# Altium schematic sheet MCU.SchDoc: Smart MCU
size A3; Author: Rinosh Baskaran; DrawnBy: Rinosh Baskaran; SheetNumber: 1; SheetTotal: 3; SPICEModelCacheKMDLVIDU: <root> / <DocumentId>KMDLVIDU</DocumentId> / <CacheFrame Number="0"> / <Model Name="cap" Kind="MDL"> / <Text>*Default semiconductor capacitor / .MODEL CAP C()</Text> / </Model> / <Model Name="xtal" Kind="CKT"> / <Text>*Generic type:crystal pkg:HC33/51 / .SUBCKT XTAL 1 2 PARAMS: FREQ=1Meg RS=750 C=13pf Q=1000 / LX 1 3 {((Q*RS)/(6.2831852*FREQ))} IC=0.5M / CX 3 4 {(1/(Q*6.2831852*FREQ*RS))} / C0 1 2 {C} / RS 4 2 {RS} / .ENDS XTAL</Text> / </Model> / </CacheFrame> / </root>
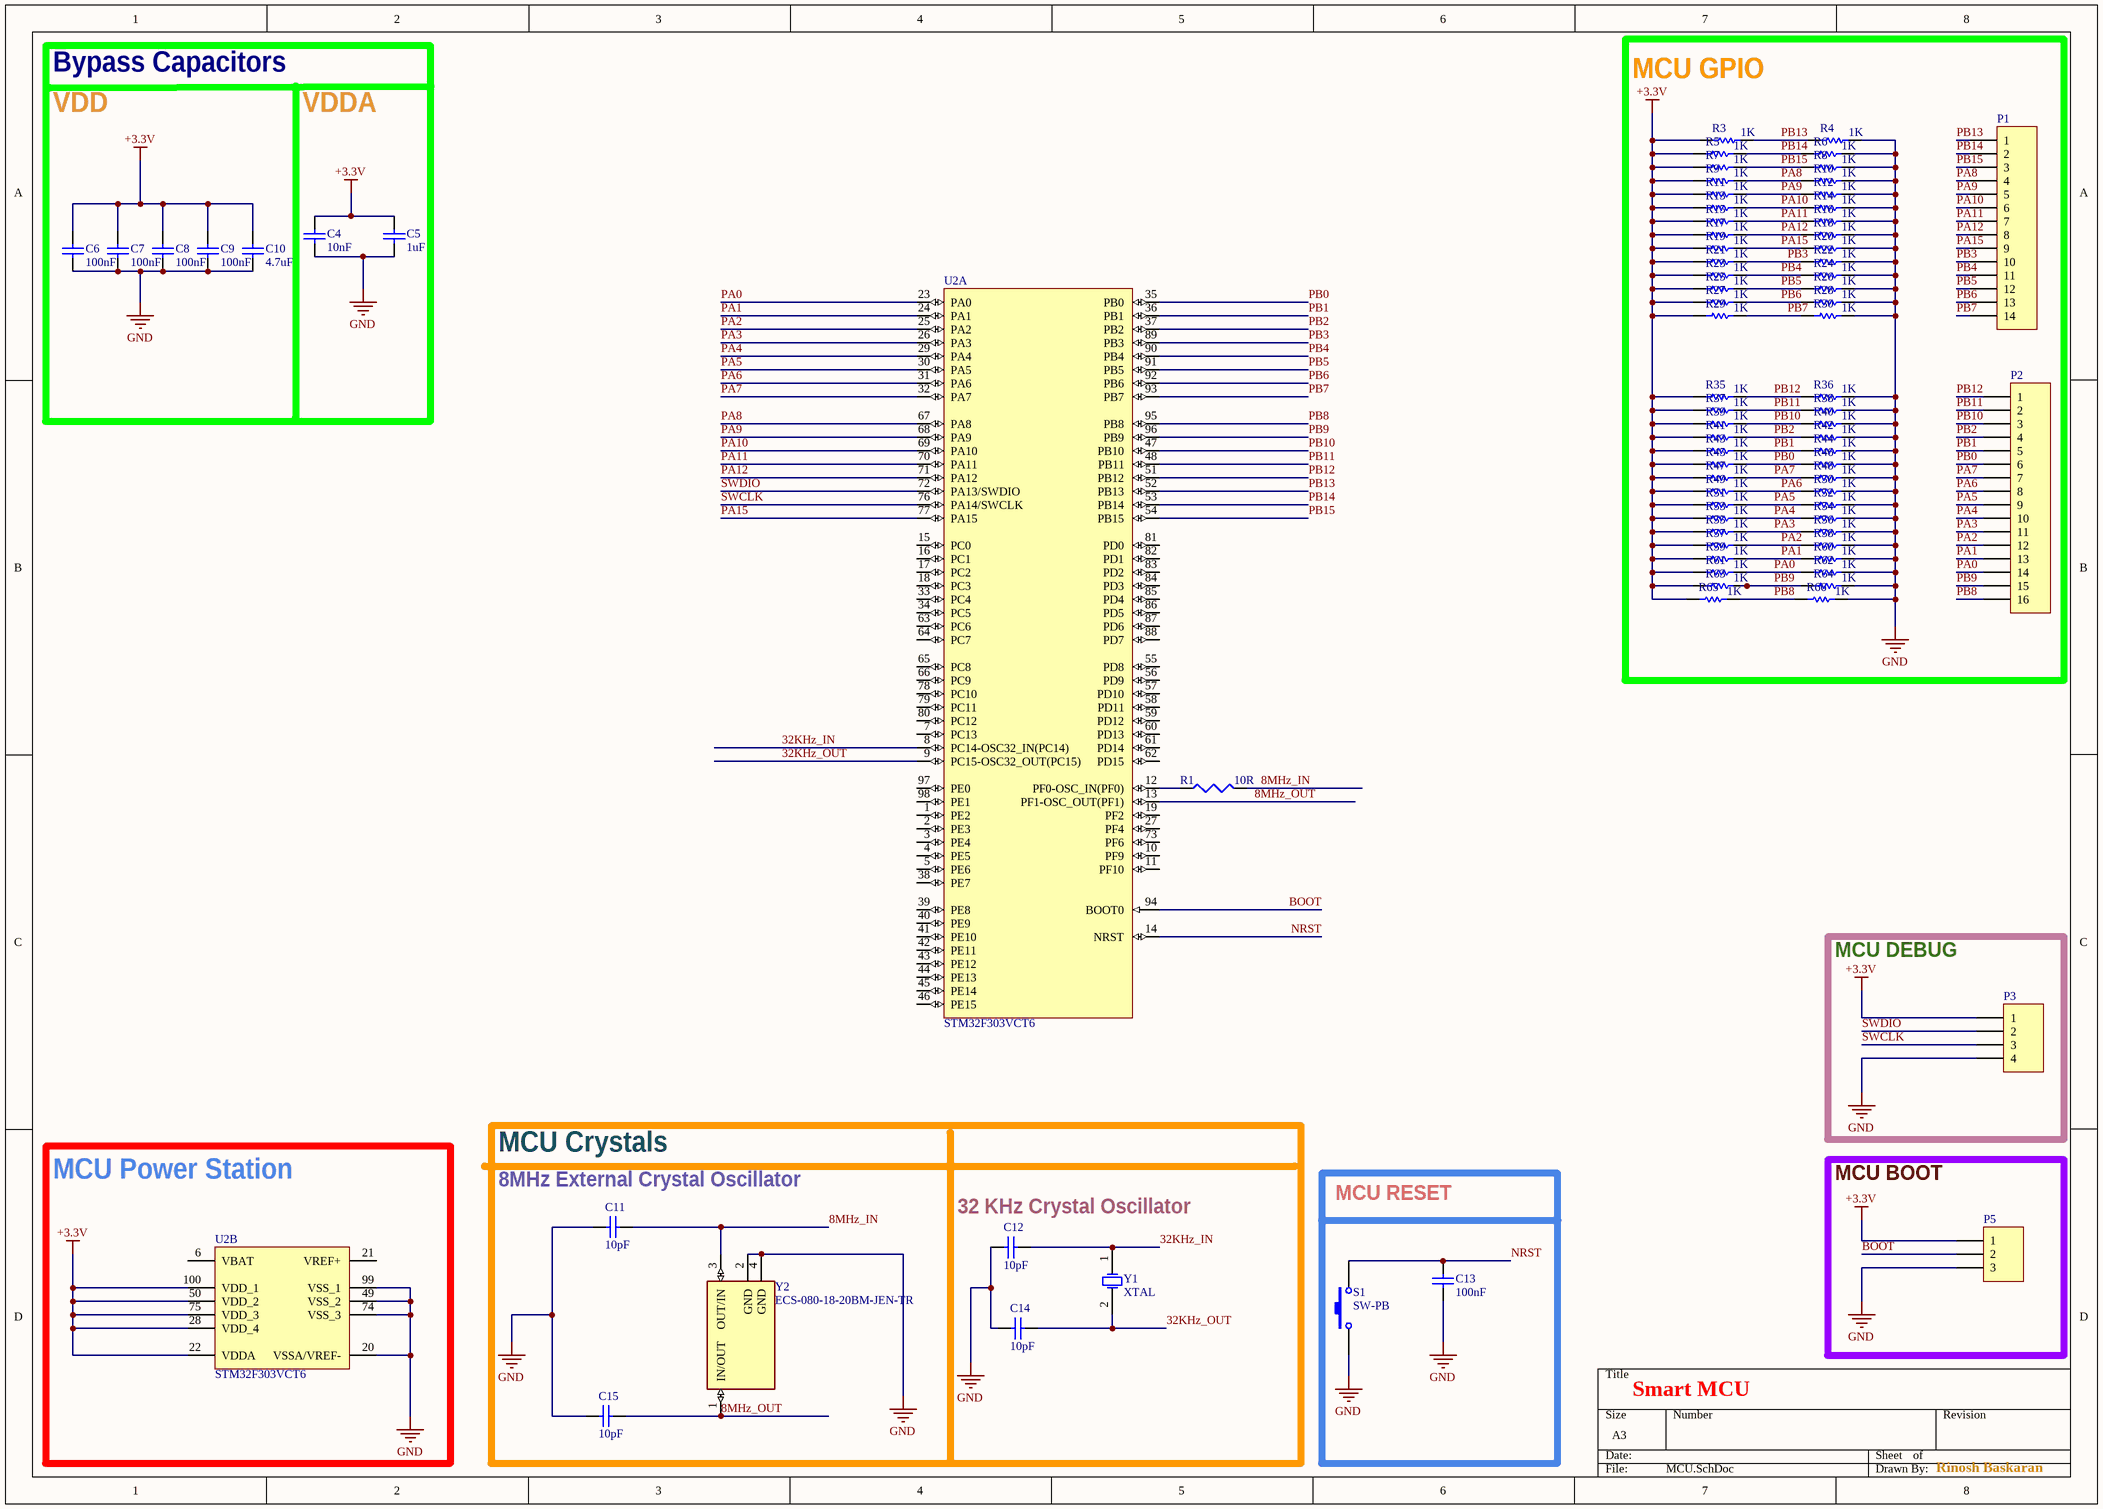
[diagram p0: MCU.SchDoc]

## Parts
C4  value 10nF  [1608[0603]]  (hidden comment: Cap Semi)
C5  value 1uF  [1608[0603]]  (hidden comment: Cap Semi)
C6  value 100nF  [1608[0603]]  (hidden comment: Cap Semi)
C7  value 100nF  [1608[0603]]  (hidden comment: Cap Semi)
C8  value 100nF  [1608[0603]]  (hidden comment: Cap Semi)
C9  value 100nF  [1608[0603]]  (hidden comment: Cap Semi)
C10  value 4.7uF  [1608[0603]]  (hidden comment: Cap Semi)
C11  value 10pF  [1608[0603]]  (hidden comment: Cap Semi)
C12  value 10pF  [1608[0603]]  (hidden comment: Cap Semi)
C13  value 100nF  [1608[0603]]  (hidden comment: Cap Semi)
C14  value 10pF  [1608[0603]]  (hidden comment: Cap Semi)
C15  value 10pF  [1608[0603]]  (hidden comment: Cap Semi)
P1  Header 14  [MY_FE14]  (value not drawn)
P2  Header 16  [MY_FE16]  (value not drawn)
P3  Header 4  [My_1X04]  (value not drawn)
P5  Header 3  [My_1X03]  (value not drawn)
R1  value 10R  [J1-0603]  (hidden comment: Res3)
R3  1K  [MY_0805]
R4  1K  [MY_0805]
R5  1K  [MY_0805]
R6  1K  [MY_0805]
R7  1K  [MY_0805]
R8  1K  [MY_0805]
R9  1K  [MY_0805]
R10  1K  [MY_0805]
R11  1K  [MY_0805]
R12  1K  [MY_0805]
R13  1K  [MY_0805]
R14  1K  [MY_0805]
R15  1K  [MY_0805]
R16  1K  [MY_0805]
R17  1K  [MY_0805]
R18  1K  [MY_0805]
R19  1K  [MY_0805]
R20  1K  [MY_0805]
R21  1K  [MY_0805]
R22  1K  [MY_0805]
R23  1K  [MY_0805]
R24  1K  [MY_0805]
R25  1K  [MY_0805]
R26  1K  [MY_0805]
R27  1K  [MY_0805]
R28  1K  [MY_0805]
R29  1K  [MY_0805]
R30  1K  [MY_0805]
R35  1K  [MY_0805]
R36  1K  [MY_0805]
R37  1K  [MY_0805]
R38  1K  [MY_0805]
R39  1K  [MY_0805]
R40  1K  [MY_0805]
R41  1K  [MY_0805]
R42  1K  [MY_0805]
R43  1K  [MY_0805]
R44  1K  [MY_0805]
R45  1K  [MY_0805]
R46  1K  [MY_0805]
R47  1K  [MY_0805]
R48  1K  [MY_0805]
R49  1K  [MY_0805]
R50  1K  [MY_0805]
R51  1K  [MY_0805]
R52  1K  [MY_0805]
R53  1K  [MY_0805]
R54  1K  [MY_0805]
R55  1K  [MY_0805]
R56  1K  [MY_0805]
R57  1K  [MY_0805]
R58  1K  [MY_0805]
R59  1K  [MY_0805]
R60  1K  [MY_0805]
R61  1K  [MY_0805]
R62  1K  [MY_0805]
R63  1K  [MY_0805]
R64  1K  [MY_0805]
R65  1K  [MY_0805]
R66  1K  [MY_0805]
S1  SW-PB  [SPST-2]
U2  STM32F303VCT6  [STM-LQFP100_N]  (parts A,B of 2)
Y1  XTAL  [R38]
Y2  ECS-080-18-20BM-JEN-TR  [ECS_ECS-060-18-20BM-JEN-TR]

## Blocks framed on the sheet
MCU GPIO: P1 P2 R3-R30 R35-R66
MCU DEBUG: P3
MCU Power Station: U2
MCU Crystals: C11 C12 C14 C15 Y1 Y2
MCU RESET: C13 S1
MCU BOOT: P5

## Nets
+3.3V: C4.2 C5.2 C6.2 C7.2 C8.2 C9.2 C10.2 P3.1 P5.1 R3.1 R5.1 R7.1 R9.1 R11.1 R13.1 R15.1 R17.1 R19.1 R21.1 R23.1 R25.1 R27.1 R29.1 R35.1 R37.1 R39.1 R41.1 R43.1 R45.1 R47.1 R49.1 R51.1 R53.1 R55.1 R57.1 R59.1 R61.1 R63.1 R65.1 U2.22(VDDA) U2.28(VDD_4) U2.50(VDD_2) U2.75(VDD_3) U2.100(VDD_1)
GND: C4.1 C5.1 C6.1 C7.1 C8.1 C9.1 C10.1 C11.2 C12.2 C13.2 C14.2 C15.2 P3.4 P5.3 R4.2 R6.2 R8.2 R10.2 R12.2 R14.2 R16.2 R18.2 R20.2 R22.2 R24.2 R26.2 R28.2 R30.2 R36.2 R38.2 R40.2 R42.2 R44.2 R46.2 R48.2 R50.2 R52.2 R54.2 R56.2 R58.2 R60.2 R62.2 R64.2 R66.2 S1.1 U2.20(VSSA/VREF-) U2.49(VSS_2) U2.74(VSS_3) U2.99(VSS_1) Y2.2(GND) Y2.4(GND)
8MHz_IN: C11.1 R1.2 Y2.3(OUT/IN)
8MHz_OUT: C15.1 U2.13(PF1-OSC_OUT(PF1)) Y2.1(IN/OUT)
32KHz_IN: C12.1 U2.8(PC14-OSC32_IN(PC14)) Y1.1(OSC1)
32KHz_OUT: C14.1 U2.9(PC15-OSC32_OUT(PC15)) Y1.2(OSC2)
BOOT: P5.2 U2.94(BOOT0)
NRST: C13.1 S1.2 U2.14(NRST)
PA0: P2.14 R61.2 R62.1 U2.23(PA0)
PA1: P2.13 R59.2 R60.1 U2.24(PA1)
PA2: P2.12 R57.2 R58.1 U2.25(PA2)
PA3: P2.11 R55.2 R56.1 U2.26(PA3)
PA4: P2.10 R53.2 R54.1 U2.29(PA4)
PA5: P2.9 R51.2 R52.1 U2.30(PA5)
PA6: P2.8 R49.2 R50.1 U2.31(PA6)
PA7: P2.7 R47.2 R48.1 U2.32(PA7)
PA8: P1.4 R9.2 R10.1 U2.67(PA8)
PA9: P1.5 R11.2 R12.1 U2.68(PA9)
PA10: P1.6 R13.2 R14.1 U2.69(PA10)
PA11: P1.7 R15.2 R16.1 U2.70(PA11)
PA12: P1.8 R17.2 R18.1 U2.71(PA12)
PA15: P1.9 R19.2 R20.1 U2.77(PA15)
PB0: P2.6 R45.2 R46.1 U2.35(PB0)
PB1: P2.5 R43.2 R44.1 U2.36(PB1)
PB2: P2.4 R41.2 R42.1 U2.37(PB2)
PB3: P1.10 R21.2 R22.1 U2.89(PB3)
PB4: P1.11 R23.2 R24.1 U2.90(PB4)
PB5: P1.12 R25.2 R26.1 U2.91(PB5)
PB6: P1.13 R27.2 R28.1 U2.92(PB6)
PB7: P1.14 R29.2 R30.1 U2.93(PB7)
PB8: P2.16 R65.2 R66.1 U2.95(PB8)
PB9: P2.15 R63.2 R64.1 U2.96(PB9)
PB10: P2.3 R39.2 R40.1 U2.47(PB10)
PB11: P2.2 R37.2 R38.1 U2.48(PB11)
PB12: P2.1 R35.2 R36.1 U2.51(PB12)
PB13: P1.1 R3.2 R4.1 U2.52(PB13)
PB14: P1.2 R5.2 R6.1 U2.53(PB14)
PB15: P1.3 R7.2 R8.1 U2.54(PB15)
SWCLK: P3.3 U2.76(PA14/SWCLK)
SWDIO: P3.2 U2.72(PA13/SWDIO)
NetR1_1: R1.1 U2.12(PF0-OSC_IN(PF0))

Not connected (* = marked no-connect by the designer): U2 1(PE2) 2(PE3) 3(PE4) 4(PE5) 5(PE6) 6(VBAT) 7(PC13) 10(PF9) 11(PF10) 15(PC0) 16(PC1) 17(PC2) 18(PC3) 19(PF2) 21(VREF+) 27(PF4) 33(PC4) 34(PC5) 38(PE7) 39(PE8) 40(PE9) 41(PE10) 42(PE11) 43(PE12) 44(PE13) 45(PE14) 46(PE15) 55(PD8) 56(PD9) 57(PD10) 58(PD11) 59(PD12) 60(PD13) 61(PD14) 62(PD15) 63(PC6) 64(PC7) 65(PC8) 66(PC9) 73(PF6) 78(PC10) 79(PC11) 80(PC12) 81(PD0) 82(PD1) 83(PD2) 84(PD3) 85(PD4) 86(PD5) 87(PD6) 88(PD7) 97(PE0) 98(PE1)

## Notes on the sheet
- Bypass Capacitors
- VDD
- VDDA
- (near C11) 8MHz External Crystal Oscillator
- (near C12) 32 KHz Crystal Oscillator

## Library data of the parts
C4-C15 = Cap Semi: Capacitor (Semiconductor SIM Model); Published: 8-Jun-2000; LatestRevisionDate: 29-May-2009; LatestRevisionNote: IPC-7351 Footprint Added.; PackageReference: C1206; Publisher: Altium Limited; PackageDescription: Chip Capacitor
P1 = Header 14: Header, 14-Pin; ASiD Part Number: Header 14-AS
P2 = Header 16: Header, 16-Pin; ASiD Part Number: Header 16-AS
P3 = Header 4: Header, 4-Pin; ASiD Part Number: Header 4-AS
P5 = Header 3: Header, 3-Pin; ASiD Part Number: Header 3-AS
R1 = Res3: Resistor; Published: 8-Jun-2000; LatestRevisionDate: 29-May-2009; LatestRevisionNote: IPC-7351 Footprint Added.; PackageReference: J1-0603; Publisher: Altium Limited; PackageDescription: Chip Resistor
R3-R30 R35-R66 = Res: Standard resistor; ASiD Part Number: Res-AS; Value: 1K
S1 = SW-PB: Switch; Published: 24-Mar-1999; LatestRevisionDate: 17-Jul-2002; LatestRevisionNote: Re-released for DXP Platform.; PackageReference: SPST-2; Publisher: Altium Limited; PackageDescription: Switch; 2 Leads
U2 = STM32F303VCT6: ARM Cortex-M4 32-bit MCU, 256 KB Flash, 40 KB Internal RAM, 87 I/Os, 100-pin LQFP, -40 to 85 degC, Tray; D/A Converter: 2x12-bit (2 Channel); FLASH Size (Prog) (kB): 256; I/Os (High Current): 87; Internal RAM Size (kB): 40; Operating Frequency(F) (Processor speed) (MHz): 72; Supply Voltage(Vcc) min (V): 2; DatasheetVersion: Rev. 6; PackageVersion: Rev. 1, 06/2013; PackageReference: LQFP100; PackageDescription: 100-Pin Low Profile Quad Flat Package, 14 x 14 mm Body, 0.5 mm Pitch; Supplier 1: Digi-Key; Supplier Part Number 1: 497-13233-ND; Supplier 2: Farnell; Supplier Part Number 2: 2215110; Supplier 3: Newark; Supplier Part Number 3: 43W6527; Supplier 4: Newark; Supplier Part Number 4: 46W2194; Supplier 5: Mouser; Supplier Part Number 5: 511-STM32F303VCT6; Core: ARM Cortex-M4; Packing: Tray; Mounting Technology: Surface Mount; PartNumber: STM32F303VCT6; ComponentLink1Description: Manufacturer URL; ComponentLink1URL: http://www.st.com/web/en/home.html; ComponentLink2Description: Datasheet; ComponentLink2URL: http://www.st.com/st-web-ui/static/active/en/resource/technical/document/datasheet/DM00058181.pdf; ComponentLink3Description: Package Specification; ComponentLink3URL: http://www.st.com/st-web-ui/static/active/en/resource/technical/document/data_brief/DM00071938.pdf
Y1 = XTAL: Crystal Oscillator; Published: 8-Jun-2000; LatestRevisionDate: 17-Jul-2002; LatestRevisionNote: Re-released for DXP Platform.; PackageReference: R38; Publisher: Altium Limited; PackageDescription: Crystal, Thru-Hole; 2 Leads; Body 3.1 x 8.2 mm (Dia.xH)
Y2 = ECS-080-18-20BM-JEN-TR: 8 MHz Â±20ppm Crystal 18pF 60 Ohms 4-SMD, No Lead; MF: ECS Inc.; SnapEDA_Link: https://www.snapeda.com/parts/ECS-080-18-20BM-JEN-TR/ECS/view-part/?ref=snap; Package: CSM-8M-20BM-4 ECS; Value: *; MP: ECS-080-18-20BM-JEN-TR; Check_prices: https://www.snapeda.com/parts/ECS-080-18-20BM-JEN-TR/ECS/view-part/?ref=eda